# EAGLE design osmo-bts-lna (EAGLE 7.7.0)
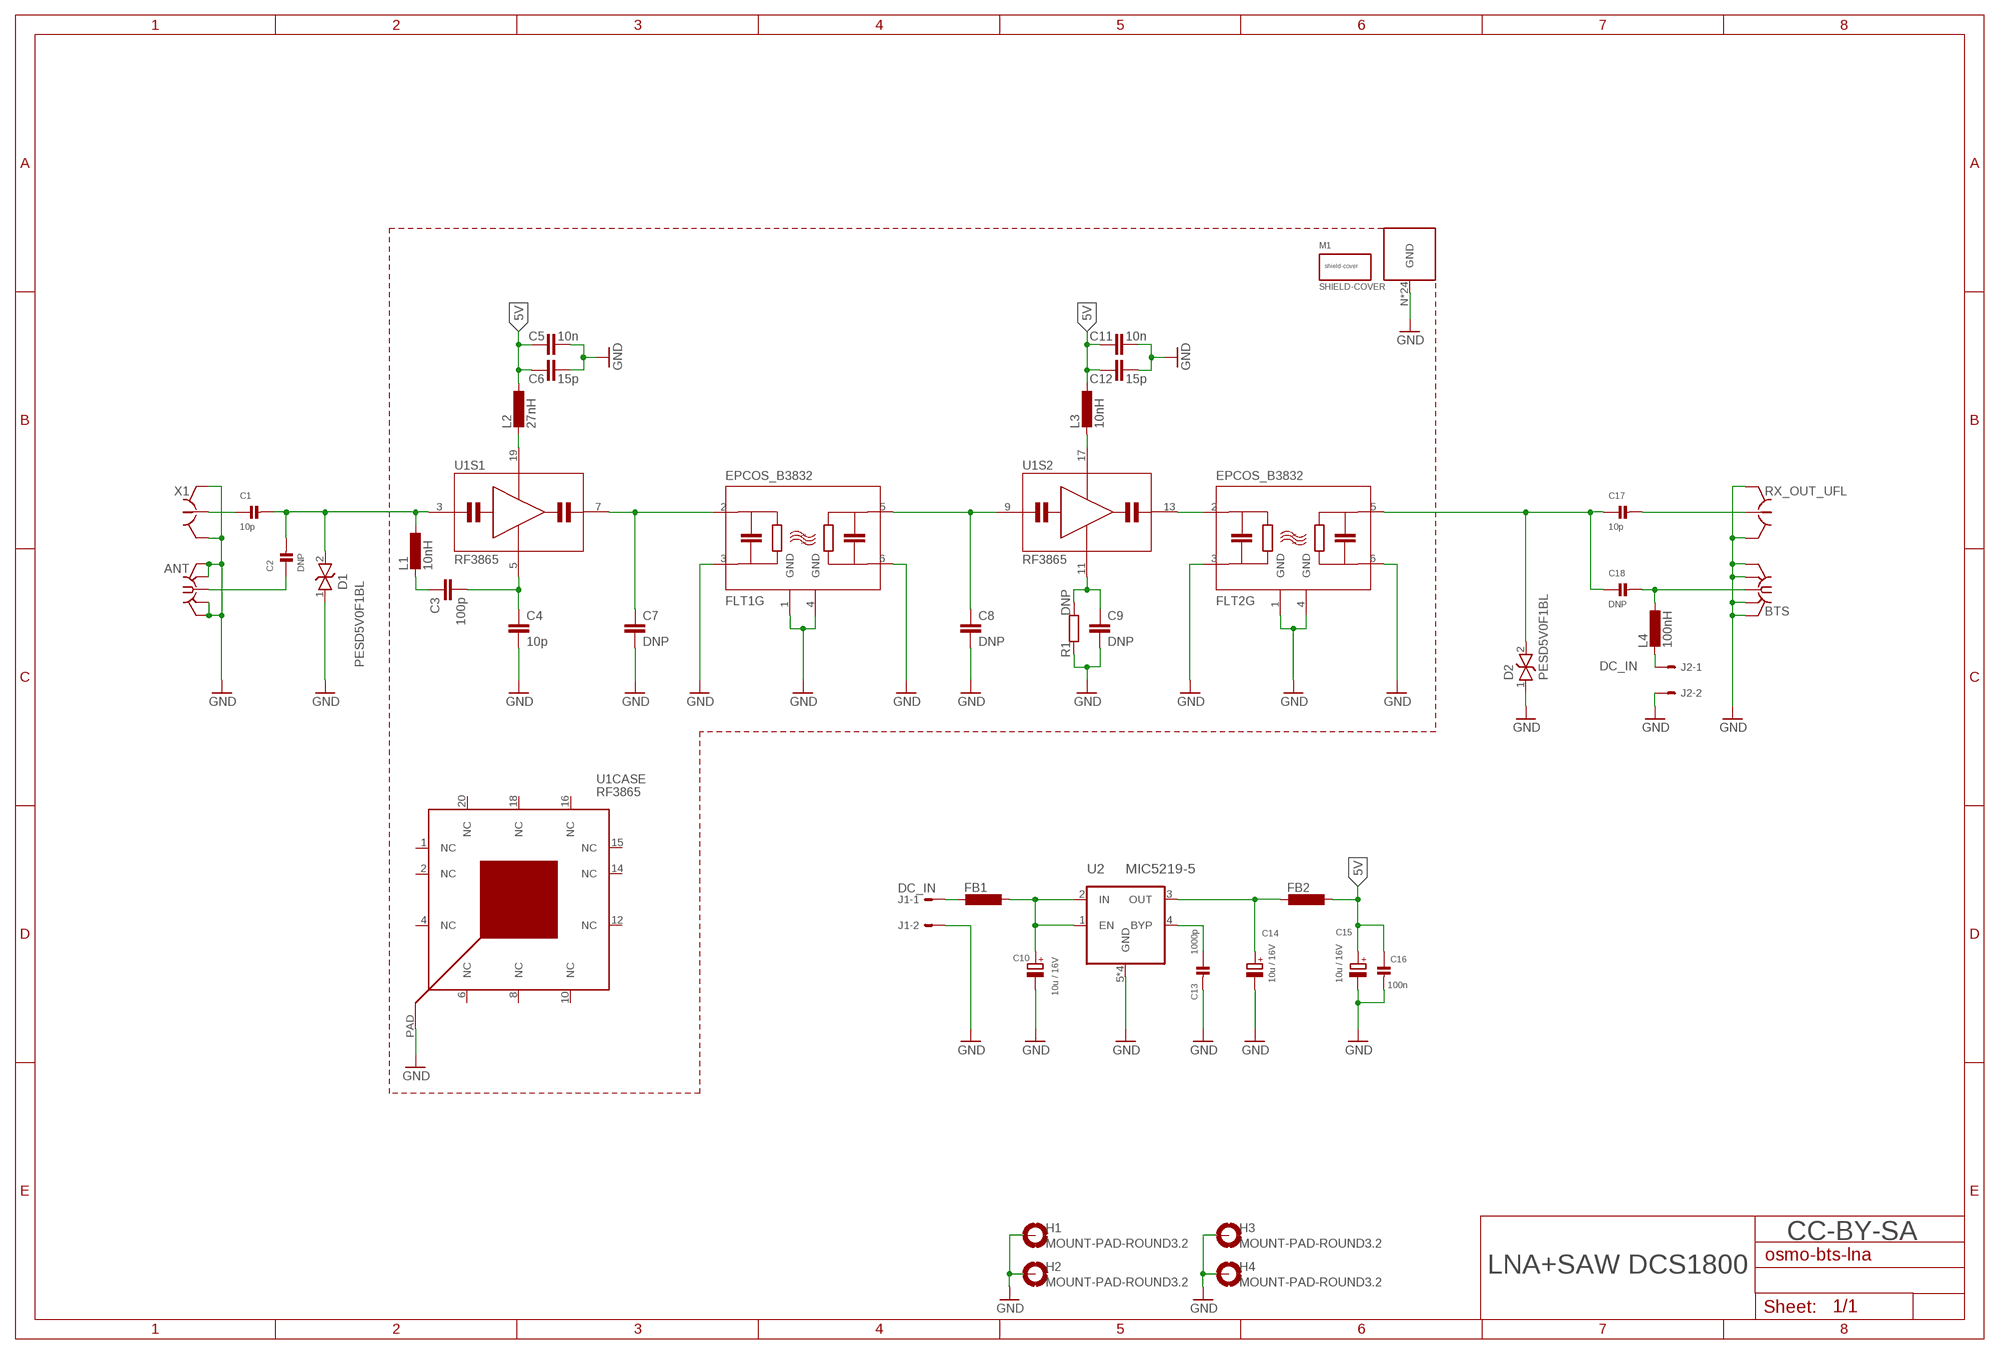
[diagram p0: schematic, sheet 1]
M1 (SHIELD-COVER): CLASS: MECHANICAL; DESCRIPTION: BOARD SHIELD 1.26X1.26" COVER; LINK: https://www.digikey.de/product-detail/de/laird-technologies-emi/BMI-S-204-C/903-1016-ND; MANUFACTURER: Laird Technologies EMI; MANUFACTURERPARTNUMBER: BMI-S-204-C; POPULATED: TRUE; ROHSCERTIFICATE: UNKNOWN ROHS CERTIFICATE; SCHEM_BOM_ITEM: TRUE; SOURCE: DIGIKEY; SOURCEPARTNUMBER: 903-1016-ND

## Parts
ANT  SMA-F-S-EDGE  [SMA-F-S-EDGE]
BTS  SMA-F-S-EDGE  [SMA-F-S-EDGE]
C1  10p  CAP_CERAMIC_0603  [_0603]
C2  DNP  CAP_CERAMIC_0603  [_0603]
C3  100p  C-EU_0603  [0603]
C4  10p  C-EU_0603  [0603]
C5  10n  C-EU_0603  [0603]
C6  15p  C-EU_0603  [0603]
C7  DNP  C-EU_0603  [0603]
C8  DNP  C-EU_0603  [0603]
C9  DNP  C-EU_0603  [0603]
C10  10u / 16V  CPOL-EU-1206  [CPOL1206]
C11  10n  C-EU_0603  [0603]
C12  15p  C-EU_0603  [0603]
C13  1000p  CAP_CERAMIC_0603  [_0603]
C14  10u / 16V  CPOL-EU-1206  [CPOL1206]
C15  10u / 16V  CPOL-EU-1206  [CPOL1206]
C16  100n  CAP_CERAMIC_0603  [_0603]
C17  10p  CAP_CERAMIC_0603  [_0603]
C18  DNP  CAP_CERAMIC_0603  [_0603]
D1  PESD5V0F1BL  D_ESD_SOD882  [SOD882]
D2  PESD5V0F1BL  D_ESD_SOD882  [SOD882]
FB1  FBEAD_1206  [1206]
FB2  INDUCTOR0603  [0603]
FLT1  EPCOS_B3832  [DCC6C]
FLT2  EPCOS_B3832  [DCC6C]
H1  MOUNT-PAD-ROUND3.2  [3,2-PAD]
H2  MOUNT-PAD-ROUND3.2  [3,2-PAD]
H3  MOUNT-PAD-ROUND3.2  [3,2-PAD]
H4  MOUNT-PAD-ROUND3.2  [3,2-PAD]
J1  DC_IN  22-27-2021-02  [6410-02]
J2  DC_IN  22-27-2021-02  [6410-02]
L1  10nH  L-EU_0603  [0603]
L2  27nH  L-EU_0603  [0603]
L3  10nH  L-EU_0603  [0603]
L4  100nH  INDUCTOR_0402  [_0402]
R1  DNP  R-EU_0603  [0603]
RX_OUT_UFL  HRS_UFL  [HRS_UFL]
SHLD1  SHIELD-BMI-S-204  [BMI-S-204]
U1  RF3865  [QFN20_5X5_PAD]
U2  MIC5219-5  MIC5219FMM8  [MSOP8]
X1  HRS_UFL  [HRS_UFL]

## Nets
5V: C5.1 C6.1 C11.1 C12.1 C15.+ C16.1 FB2.2 L2.1 L3.1
DC_IN: FB1.1 J1.1
DC_IN_FLT: C10.+ FB1.2 U2.1(EN) U2.2(IN)
GND: ANT.BG1(GND) ANT.BG2(GND) ANT.TG1(GND) ANT.TG2(GND) BTS.BG1(GND) BTS.BG2(GND) BTS.TG1(GND) BTS.TG2(GND) C4.2 C5.2 C6.2 C7.2 C8.2 C9.2 C10.- C11.2 C12.2 C13.2 C14.- C15.- C16.2 D1.1 D2.1 FLT1.1(CASE:GND) FLT1.3(G:IN_GND) FLT1.4(CASE:GND) FLT1.6(G:OUT_GND) FLT2.1(CASE:GND) FLT2.3(G:IN_GND) FLT2.4(CASE:GND) FLT2.6(G:OUT_GND) H1.B3,2(MOUNT) H2.B3,2(MOUNT) H3.B3,2(MOUNT) H4.B3,2(MOUNT) J1.2 J2.2 R1.1 RX_OUT_UFL.GND@1(GND) RX_OUT_UFL.GND@2(GND) SHLD1.N(GND) SHLD1.NNE1(GND) SHLD1.NNE2(GND) SHLD1.NNE4(GND) SHLD1.NNE5(GND) SHLD1.NNE(GND) SHLD1.NNW(GND) SHLD1.S1(GND) SHLD1.S2(GND) SHLD1.S3(GND) SHLD1.S4(GND) SHLD1.S5(GND) SHLD1.S6(GND) SHLD1.S7(GND) SHLD1.S8(GND) SHLD1.S9(GND) SHLD1.S(GND) SHLD1.SSE(GND) SHLD1.SSW1(GND) SHLD1.SSW2(GND) SHLD1.SSW3(GND) SHLD1.SSW4(GND) SHLD1.SSW5(GND) SHLD1.SSW(GND) U1.PAD(CASE:CASE_GND) U2.5(GND) U2.6(GND) U2.7(GND) U2.8(GND) X1.GND@1(GND) X1.GND@2(GND)
N$1: L2.2 U1.19(S1:VDD)
N$2: ANT.C C2.1
N$3: C13.1 U2.4(BYP)
N$4: C3.1 L1.2
N$5: C3.2 C4.1 U1.5(S1:AC_GND)
N$6: C9.1 R1.2 U1.11(S2:AC_GND)
N$7: C1.1 X1.SIG
N$8: C17.2 RX_OUT_UFL.SIG
N$9: C17.1 C18.1 D2.2 FLT2.5(G:OUT)
N$10: L3.2 U1.17(S2:VDD)
N$11: J2.1 L4.2
N$12: C14.+ FB2.1 U2.3(OUT)
RF_UPLINK: C1.2 C2.2 D1.2 L1.1 U1.3(S1:RF_IN)
RF_UPLINK_IS_IN: C8.1 FLT1.5(G:OUT) U1.9(S2:RF_IN)
RF_UPLINK_IS_OUT: C7.1 FLT1.2(G:IN) U1.7(S1:RF_OUT)
RF_UPLINK_LNA_OUT: FLT2.2(G:IN) U1.13(S2:RF_OUT)
RF_UPLINK_OUT: BTS.C C18.2 L4.1
Unconnected: U1.1(CASE:NC) U1.2(CASE:NC) U1.4(CASE:NC) U1.6(CASE:NC) U1.8(CASE:NC) U1.10(CASE:NC) U1.12(CASE:NC) U1.14(CASE:NC) U1.15(CASE:NC) U1.16(CASE:NC) U1.18(CASE:NC) U1.20(CASE:NC)

## Notes on the sheet
- CC-BY-SA
- LNA+SAW DCS1800

## Library data of the parts
ANT BTS = osmo-bts-lna:SMA-F; CLASS: CONNECTOR; DESCRIPTION: NO DESCRIPTION; LINK: UNKNOWN LINK; MANUFACTURER: UNKNOWN MANUFACTURER; MANUFACTURERPARTNUMBER: UNKNOWN MANUFACTURER PART NUMBER; POPULATED: TRUE; ROHSCERTIFICATE: UNKNOWN ROHS CERTIFICATE; SOURCE: UNKNOWN SOURCE; SOURCEPARTNUMBER: UNKNOWN SOURCE PART NUMBER
C1 C17 = osmo-bts-lna:CAP_CERAMIC: Ceramic Capacitors 0402 - 0402 Surface Mount Capacitors 16pF 50V 5% [Digikey: 445-4899-2-ND] 18pF 50V 5% [Digikey: 490-1281-2-ND] 22pF 50V 5% [Digikey: 490-1283-2-ND] 68pF 50V 5% [Digikey: 490-1289-2-ND] 0.1uF 10V 10% [Digikey: 490-1318-2-ND] 1.0uF 6.3V 10% [Digikey: 490-1320-2-ND] 0603 - 0603 Surface Mount Capacitors 16 pF 50V 5% [Digikey: 445-5051-2-ND] 22 pF 50V [Digikey: PCC220ACVTR-ND] 33 pF 50V 5% [Digikey: 490-1415-1-ND] 56pF 50V 5% [Digikey: 490-1421-1-ND] 220pF 50V 5% [Digikey: 445-1285-1-ND] 680 pF 50V 2200 pF 50V 5% C0G [Digikey: 445-1297-1-ND] 5600 pF 100V 5% X7R [Digikey: 478-3711-1-ND] 0.1 µF 25V 10% [Digikey: PCC2277TR-ND] 0.22 µF 16V 10% X7R [Digikey: 445-1318-1-ND] 1.0 µF 25V 10% [Digikey: 445-5146-2-ND] 0603 - RF Specific 3pF 250V +/-0.1pF RF [Digikey: 712-1347-1-ND] 18 pF 250V 5% [Digikey: 478-3505-1-ND or 712-1322-1-ND] 56 pF 250V 5% C0G RF [Digikey: 490-4867-1-ND] 68 pF 250V RF [Digikey: 490-4868-1-ND] 0805 - 0805 Surface Mount Capacitors 220 pF 250V 2% RF Ceramic Capacitor [Digikey: 712-1398-1-ND] 1000 pF 50V 2% NP0 Ceramic Capacitor [Digikey: 478-3760-1-ND] 0.1 µF 25V 10% Ceramic Capacitor [Digikey: PCC1828TR-ND] 1.0 µF 16V 10% Ceramic Capacitor[Digikey: 490-1691-2-ND] 10.0 µF 10V 10% Ceramic Capacitor[Digikey: 709-1228-1-ND] 10.0 uF 16V 10% Ceramic Capacitor [Digikey: 478-5165-2-ND] 47 uF 6.3V 20% Ceramic Capacitor [Digikey: 587-1779-1-ND or 399-5506-1-ND] 1206 - 1206 Surface Mount Capacitors 47uF 10V 20% Ceramic Capacitor [Digikey: 490-5528-1-ND or 399-5508-1-ND or 445-6010-1-ND] 100uF 6.3V -20%, +80% Y5V Ceramic Capacitor (Digikey: 490-4512-1-ND, Mouser: 81-GRM31CF50J107ZE1L) 1810 - 1810 Surface Mount Capacitors High volt MLC; no solder stop between for higher isolation; CLASS: CAPACITOR; DESCRIPTION: CAP CER 10PF 50V C0G/NP0 0603; LINK: http://www.digikey.de/product-detail/de/C0603C100J5GACTU/399-1049-1-ND; MANUFACTURER: KEMET; MANUFACTURERPARTNUMBER: C0603C100J5GACTU; POPULATED: TRUE; ROHSCERTIFICATE: UNKNOWN ROHS CERTIFICATE; SOURCE: DIGIKEY; SOURCEPARTNUMBER: 399-1049-1-ND
C2 C18 = osmo-bts-lna:CAP_CERAMIC: Ceramic Capacitors 0402 - 0402 Surface Mount Capacitors 16pF 50V 5% [Digikey: 445-4899-2-ND] 18pF 50V 5% [Digikey: 490-1281-2-ND] 22pF 50V 5% [Digikey: 490-1283-2-ND] 68pF 50V 5% [Digikey: 490-1289-2-ND] 0.1uF 10V 10% [Digikey: 490-1318-2-ND] 1.0uF 6.3V 10% [Digikey: 490-1320-2-ND] 0603 - 0603 Surface Mount Capacitors 16 pF 50V 5% [Digikey: 445-5051-2-ND] 22 pF 50V [Digikey: PCC220ACVTR-ND] 33 pF 50V 5% [Digikey: 490-1415-1-ND] 56pF 50V 5% [Digikey: 490-1421-1-ND] 220pF 50V 5% [Digikey: 445-1285-1-ND] 680 pF 50V 2200 pF 50V 5% C0G [Digikey: 445-1297-1-ND] 5600 pF 100V 5% X7R [Digikey: 478-3711-1-ND] 0.1 µF 25V 10% [Digikey: PCC2277TR-ND] 0.22 µF 16V 10% X7R [Digikey: 445-1318-1-ND] 1.0 µF 25V 10% [Digikey: 445-5146-2-ND] 0603 - RF Specific 3pF 250V +/-0.1pF RF [Digikey: 712-1347-1-ND] 18 pF 250V 5% [Digikey: 478-3505-1-ND or 712-1322-1-ND] 56 pF 250V 5% C0G RF [Digikey: 490-4867-1-ND] 68 pF 250V RF [Digikey: 490-4868-1-ND] 0805 - 0805 Surface Mount Capacitors 220 pF 250V 2% RF Ceramic Capacitor [Digikey: 712-1398-1-ND] 1000 pF 50V 2% NP0 Ceramic Capacitor [Digikey: 478-3760-1-ND] 0.1 µF 25V 10% Ceramic Capacitor [Digikey: PCC1828TR-ND] 1.0 µF 16V 10% Ceramic Capacitor[Digikey: 490-1691-2-ND] 10.0 µF 10V 10% Ceramic Capacitor[Digikey: 709-1228-1-ND] 10.0 uF 16V 10% Ceramic Capacitor [Digikey: 478-5165-2-ND] 47 uF 6.3V 20% Ceramic Capacitor [Digikey: 587-1779-1-ND or 399-5506-1-ND] 1206 - 1206 Surface Mount Capacitors 47uF 10V 20% Ceramic Capacitor [Digikey: 490-5528-1-ND or 399-5508-1-ND or 445-6010-1-ND] 100uF 6.3V -20%, +80% Y5V Ceramic Capacitor (Digikey: 490-4512-1-ND, Mouser: 81-GRM31CF50J107ZE1L) 1810 - 1810 Surface Mount Capacitors High volt MLC; no solder stop between for higher isolation; CLASS: CAPACITOR; DESCRIPTION: NO DESCRIPTION; LINK: UNKNOWN LINK; MANUFACTURER: UNKNOWN MANUFACTURER; MANUFACTURERPARTNUMBER: UNKNOWN MANUFACTURER PART NUMBER; POPULATED: TRUE; ROHSCERTIFICATE: UNKNOWN ROHS CERTIFICATE; SOURCE: UNKNOWN SOURCE; SOURCEPARTNUMBER: UNKNOWN SOURCE PART NUMBER
C3 = osmo-bts-lna:C-EU: Capacitor; CLASS: CAPACITOR; DESCRIPTION: CAP CER 100PF 50V C0G/NP0 0603; LINK: https://www.digikey.de/product-detail/de/avx-corporation/06035A101FAT2A/478-6202-1-ND; MANUFACTURER: AVX Corporation; MANUFACTURERPARTNUMBER: 06035A101FAT2A; POPULATED: TRUE; ROHSCERTIFICATE: UNKNOWN ROHS CERTIFICATE; SOURCE: DIGIKEY; SOURCEPARTNUMBER: 478-6202-1-ND
C4 = osmo-bts-lna:C-EU: Capacitor; CLASS: CAPACITOR; DESCRIPTION: CAP CER 10PF 50V C0G/NP0 0603; LINK: http://www.digikey.de/product-detail/de/C0603C100J5GACTU/399-1049-1-ND; MANUFACTURER: KEMET; MANUFACTURERPARTNUMBER: C0603C100J5GACTU; POPULATED: TRUE; ROHSCERTIFICATE: UNKNOWN ROHS CERTIFICATE; SOURCE: DIGIKEY; SOURCEPARTNUMBER: 399-1049-1-ND
C5 C11 = osmo-bts-lna:C-EU: Capacitor; CLASS: CAPACITOR; DESCRIPTION: CAP CER 10000PF 100V X7R 0603; LINK: https://www.digikey.de/product-detail/de/murata-electronics-north-america/GCM188R72A103KA37D/490-4781-1-ND; MANUFACTURER: Murata Electronics North America; MANUFACTURERPARTNUMBER: GCM188R72A103KA37D; POPULATED: TRUE; ROHSCERTIFICATE: UNKNOWN ROHS CERTIFICATE; SOURCE: DIGIKEY; SOURCEPARTNUMBER: 490-4781-1-ND
C6 C12 = osmo-bts-lna:C-EU: Capacitor; CLASS: CAPACITOR; DESCRIPTION: CAP CER 15PF 50V C0G/NP0 0603; LINK: https://www.digikey.de/product-detail/de/samsung-electro-mechanics/CL10C150JB8NCNC/1276-2190-1-ND; MANUFACTURER: Samsung Electro-Mechanics; MANUFACTURERPARTNUMBER: CL10C150JB8NCNC; POPULATED: TRUE; ROHSCERTIFICATE: UNKNOWN ROHS CERTIFICATE; SOURCE: DIGIKEY; SOURCEPARTNUMBER: 1276-2190-1-ND
C7-C9 = osmo-bts-lna:C-EU: Capacitor; CLASS: CAPACITOR; DESCRIPTION: NO DESCRIPTION; LINK: UNKNOWN LINK; MANUFACTURER: UNKNOWN MANUFACTURER; MANUFACTURERPARTNUMBER: UNKNOWN MANUFACTURER PART NUMBER; POPULATED: FALSE; ROHSCERTIFICATE: UNKNOWN ROHS CERTIFICATE; SOURCE: UNKNOWN SOURCE; SOURCEPARTNUMBER: UNKNOWN SOURCE PART NUMBER
C10 C14 C15 = osmo-bts-lna:CPOL-EU; CLASS: CAPACITOR; DESCRIPTION: CAP CER 10UF 16V X5R 0805; LINK: https://www.digikey.de/product-detail/de/samsung-electro-mechanics/CL21A106KOCLRNC/1276-2399-1-ND; MANUFACTURER: Samsung Electro-Mechanics; MANUFACTURERPARTNUMBER: CL21A106KOCLRNC; POPULATED: TRUE; ROHSCERTIFICATE: UNKNOWN ROHS CERTIFICATE; SOURCE: DIGIKEY; SOURCEPARTNUMBER: 1276-2399-1-ND
C13 = osmo-bts-lna:CAP_CERAMIC: Ceramic Capacitors 0402 - 0402 Surface Mount Capacitors 16pF 50V 5% [Digikey: 445-4899-2-ND] 18pF 50V 5% [Digikey: 490-1281-2-ND] 22pF 50V 5% [Digikey: 490-1283-2-ND] 68pF 50V 5% [Digikey: 490-1289-2-ND] 0.1uF 10V 10% [Digikey: 490-1318-2-ND] 1.0uF 6.3V 10% [Digikey: 490-1320-2-ND] 0603 - 0603 Surface Mount Capacitors 16 pF 50V 5% [Digikey: 445-5051-2-ND] 22 pF 50V [Digikey: PCC220ACVTR-ND] 33 pF 50V 5% [Digikey: 490-1415-1-ND] 56pF 50V 5% [Digikey: 490-1421-1-ND] 220pF 50V 5% [Digikey: 445-1285-1-ND] 680 pF 50V 2200 pF 50V 5% C0G [Digikey: 445-1297-1-ND] 5600 pF 100V 5% X7R [Digikey: 478-3711-1-ND] 0.1 µF 25V 10% [Digikey: PCC2277TR-ND] 0.22 µF 16V 10% X7R [Digikey: 445-1318-1-ND] 1.0 µF 25V 10% [Digikey: 445-5146-2-ND] 0603 - RF Specific 3pF 250V +/-0.1pF RF [Digikey: 712-1347-1-ND] 18 pF 250V 5% [Digikey: 478-3505-1-ND or 712-1322-1-ND] 56 pF 250V 5% C0G RF [Digikey: 490-4867-1-ND] 68 pF 250V RF [Digikey: 490-4868-1-ND] 0805 - 0805 Surface Mount Capacitors 220 pF 250V 2% RF Ceramic Capacitor [Digikey: 712-1398-1-ND] 1000 pF 50V 2% NP0 Ceramic Capacitor [Digikey: 478-3760-1-ND] 0.1 µF 25V 10% Ceramic Capacitor [Digikey: PCC1828TR-ND] 1.0 µF 16V 10% Ceramic Capacitor[Digikey: 490-1691-2-ND] 10.0 µF 10V 10% Ceramic Capacitor[Digikey: 709-1228-1-ND] 10.0 uF 16V 10% Ceramic Capacitor [Digikey: 478-5165-2-ND] 47 uF 6.3V 20% Ceramic Capacitor [Digikey: 587-1779-1-ND or 399-5506-1-ND] 1206 - 1206 Surface Mount Capacitors 47uF 10V 20% Ceramic Capacitor [Digikey: 490-5528-1-ND or 399-5508-1-ND or 445-6010-1-ND] 100uF 6.3V -20%, +80% Y5V Ceramic Capacitor (Digikey: 490-4512-1-ND, Mouser: 81-GRM31CF50J107ZE1L) 1810 - 1810 Surface Mount Capacitors High volt MLC; no solder stop between for higher isolation; CLASS: CAPACITOR; DESCRIPTION: CAP CER 1000PF 16V 10% X7R 0402; LINK: http://www.digikey.de/product-detail/de/CC0402KRX7R7BB102/311-1352-1-ND/2103136; MANUFACTURER: Yageo; MANUFACTURERPARTNUMBER: CC0402KRX7R7BB102; POPULATED: TRUE; ROHSCERTIFICATE: Bleifrei / RoHS-konform; SOURCE: DIGIKEY; SOURCEPARTNUMBER: 311-1352-1-ND
C16 = osmo-bts-lna:CAP_CERAMIC: Ceramic Capacitors 0402 - 0402 Surface Mount Capacitors 16pF 50V 5% [Digikey: 445-4899-2-ND] 18pF 50V 5% [Digikey: 490-1281-2-ND] 22pF 50V 5% [Digikey: 490-1283-2-ND] 68pF 50V 5% [Digikey: 490-1289-2-ND] 0.1uF 10V 10% [Digikey: 490-1318-2-ND] 1.0uF 6.3V 10% [Digikey: 490-1320-2-ND] 0603 - 0603 Surface Mount Capacitors 16 pF 50V 5% [Digikey: 445-5051-2-ND] 22 pF 50V [Digikey: PCC220ACVTR-ND] 33 pF 50V 5% [Digikey: 490-1415-1-ND] 56pF 50V 5% [Digikey: 490-1421-1-ND] 220pF 50V 5% [Digikey: 445-1285-1-ND] 680 pF 50V 2200 pF 50V 5% C0G [Digikey: 445-1297-1-ND] 5600 pF 100V 5% X7R [Digikey: 478-3711-1-ND] 0.1 µF 25V 10% [Digikey: PCC2277TR-ND] 0.22 µF 16V 10% X7R [Digikey: 445-1318-1-ND] 1.0 µF 25V 10% [Digikey: 445-5146-2-ND] 0603 - RF Specific 3pF 250V +/-0.1pF RF [Digikey: 712-1347-1-ND] 18 pF 250V 5% [Digikey: 478-3505-1-ND or 712-1322-1-ND] 56 pF 250V 5% C0G RF [Digikey: 490-4867-1-ND] 68 pF 250V RF [Digikey: 490-4868-1-ND] 0805 - 0805 Surface Mount Capacitors 220 pF 250V 2% RF Ceramic Capacitor [Digikey: 712-1398-1-ND] 1000 pF 50V 2% NP0 Ceramic Capacitor [Digikey: 478-3760-1-ND] 0.1 µF 25V 10% Ceramic Capacitor [Digikey: PCC1828TR-ND] 1.0 µF 16V 10% Ceramic Capacitor[Digikey: 490-1691-2-ND] 10.0 µF 10V 10% Ceramic Capacitor[Digikey: 709-1228-1-ND] 10.0 uF 16V 10% Ceramic Capacitor [Digikey: 478-5165-2-ND] 47 uF 6.3V 20% Ceramic Capacitor [Digikey: 587-1779-1-ND or 399-5506-1-ND] 1206 - 1206 Surface Mount Capacitors 47uF 10V 20% Ceramic Capacitor [Digikey: 490-5528-1-ND or 399-5508-1-ND or 445-6010-1-ND] 100uF 6.3V -20%, +80% Y5V Ceramic Capacitor (Digikey: 490-4512-1-ND, Mouser: 81-GRM31CF50J107ZE1L) 1810 - 1810 Surface Mount Capacitors High volt MLC; no solder stop between for higher isolation; CLASS: CAPACITOR; DESCRIPTION: CAP CER 0.1UF 16V X7R 0603; LINK: http://www.digikey.de/product-detail/de/foo/1276-1005-1-ND; MANUFACTURER: Samsung Electro-Mechanics; MANUFACTURERPARTNUMBER: CL10B104KO8NNNC; POPULATED: TRUE; ROHSCERTIFICATE: UNKNOWN ROHS CERTIFICATE; SOURCE: DIGIKEY; SOURCEPARTNUMBER: 1276-1005-1-ND
D1 D2 = osmo-bts-lna:D_ESD: Diode for ESD Protection Transient suppressors; CLASS: DIODE; DESCRIPTION: TVS DIODE 5.5V 15V SOD882; LINK: https://www.digikey.de/product-detail/de/nexperia-usa-inc/PESD5V0F1BL315/1727-5794-1-ND; MANUFACTURER: Nexperia USA Inc.; MANUFACTURERPARTNUMBER: PESD5V0F1BL,315; POPULATED: TRUE; ROHSCERTIFICATE: UNKNOWN ROHS CERTIFICATE; SOURCE: DIGIKEY; SOURCEPARTNUMBER: 1727-5794-1-ND
FB1 = osmo-bts-lna:FBEAD: INDUCTOR SMD Bead inductor; CLASS: INDUCTOR; DESCRIPTION: FERRITE BEAD 1 KOHM 0805 1LN; LINK: https://www.digikey.de/product-detail/de/laird-signal-integrity-products/HZ0805D102R-10/240-2397-1-ND; MANUFACTURER: Laird-Signal Integrity Products; MANUFACTURERPARTNUMBER: HZ0805D102R-10; POPULATED: TRUE; ROHSCERTIFICATE: UNKNOWN ROHS CERTIFICATE; SOURCE: DIGIKEY; SOURCEPARTNUMBER: 240-2397-1-ND
FB2 = osmo-bts-lna:INDUCTOR; CLASS: INDUCTOR; DESCRIPTION: FERRITE BEAD 1 KOHM 0805 1LN; LINK: https://www.digikey.de/product-detail/de/laird-signal-integrity-products/HZ0805D102R-10/240-2397-1-ND; MANUFACTURER: Laird-Signal Integrity Products; MANUFACTURERPARTNUMBER: HZ0805D102R-10; POPULATED: TRUE; ROHSCERTIFICATE: UNKNOWN ROHS CERTIFICATE; SOURCE: DIGIKEY; SOURCEPARTNUMBER: 240-2397-1-ND
FLT1 FLT2 = osmo-bts-lna:EPCOS_B3832; CLASS: UNKNOWN CLASS; DESCRIPTION: NO DESCRIPTION; LINK: UNKNOWN LINK; MANUFACTURER: UNKNOWN MANUFACTURER; MANUFACTURERPARTNUMBER: UNKNOWN MANUFACTURER PART NUMBER; POPULATED: TRUE; ROHSCERTIFICATE: UNKNOWN ROHS CERTIFICATE; SOURCE: UNKNOWN SOURCE; SOURCEPARTNUMBER: UNKNOWN SOURCE PART NUMBER
H1-H4 = osmo-bts-lna:MOUNT-PAD-ROUND: MOUNTING PAD, round; CLASS: HOLE; DESCRIPTION: NO DESCRIPTION; LINK: UNKNOWN LINK; MANUFACTURER: UNKNOWN MANUFACTURER; MANUFACTURERPARTNUMBER: UNKNOWN MANUFACTURER PART NUMBER; POPULATED: FALSE; ROHSCERTIFICATE: UNKNOWN ROHS CERTIFICATE; SOURCE: UNKNOWN SOURCE; SOURCEPARTNUMBER: UNKNOWN SOURCE PART NUMBER
J1 J2 = osmo-bts-lna:22-?-02: CONNECTOR wire to board 2.54 mm (.1 inch) pitch header; CLASS: CONNECTOR\JUMPER; DESCRIPTION: NO DESCRIPTION; LINK: UNKNOWN LINK; MANUFACTURER: UNKNOWN MANUFACTURER; MANUFACTURERPARTNUMBER: UNKNOWN MANUFACTURER PART NUMBER; OC_FARNELL: unknown; OC_NEWARK: unknown; POPULATED: TRUE; ROHSCERTIFICATE: UNKNOWN ROHS CERTIFICATE; SOURCE: UNKNOWN SOURCE; SOURCEPARTNUMBER: UNKNOWN SOURCE PART NUMBER
L1 L3 = osmo-bts-lna:L-EU: Inductor; CLASS: INDUCTOR; DESCRIPTION: FIXED IND 10NH 700MA 130 MOHM; LINK: https://www.digikey.de/product-detail/de/bourns-inc/PM0603-10NJ-RC/M8484CT-ND; MANUFACTURER: Bourns Inc.; MANUFACTURERPARTNUMBER: PM0603-10NJ-RC; POPULATED: TRUE; ROHSCERTIFICATE: UNKNOWN ROHS CERTIFICATE; SOURCE: DIGIKEY; SOURCEPARTNUMBER: M8484CT-ND
L2 = osmo-bts-lna:L-EU: Inductor; CLASS: INDUCTOR; DESCRIPTION: FIXED IND 27NH 600MA 220 MOHM; LINK: https://www.digikey.de/product-detail/de/bourns-inc/PM0603-27NJ-RC/M8486CT-ND; MANUFACTURER: Bourns Inc.; MANUFACTURERPARTNUMBER: PM0603-27NJ-RC; POPULATED: TRUE; ROHSCERTIFICATE: UNKNOWN ROHS CERTIFICATE; SOURCE: DIGIKEY; SOURCEPARTNUMBER: M8486CT-ND
L4 = osmo-bts-lna:INDUCTOR; CLASS: INDUCTOR; DESCRIPTION: FIXED IND 100NH 500MA 1.25 OHM; LINK: https://www.digikey.de/product-detail/de/murata-electronics-north-america/LQG15HHR10J02D/490-11670-1-ND; MANUFACTURER: Murata Electronics North America; MANUFACTURERPARTNUMBER: LQG15HHR10J02D; POPULATED: TRUE; ROHSCERTIFICATE: UNKNOWN ROHS CERTIFICATE; SOURCE: DIGIKEY; SOURCEPARTNUMBER: 490-11670-1-ND
R1 = osmo-bts-lna:R-EU: Resistor; CLASS: RESISTOR; DESCRIPTION: NO DESCRIPTION; LINK: UNKNOWN LINK; MANUFACTURER: UNKNOWN MANUFACTURER; MANUFACTURERPARTNUMBER: UNKNOWN MANUFACTURER PART NUMBER; POPULATED: TRUE; ROHSCERTIFICATE: UNKNOWN ROHS CERTIFICATE; SOURCE: UNKNOWN SOURCE; SOURCEPARTNUMBER: UNKNOWN SOURCE PART NUMBER
RX_OUT_UFL X1 = osmo-bts-lna:HRS_UFL: Hirose U.FL SMT; CLASS: CONNECTOR; DESCRIPTION: CONN U.FL RCPT STR 50 OHM SMD; LINK: http://www.digikey.de/product-detail/de/hirose-electric-co-ltd/U.FL-R-SMT(01)/H9161-ND; MANUFACTURER: Hirose Electric Co Ltd; MANUFACTURERPARTNUMBER: U.FL-R-SMT(01); POPULATED: TRUE; ROHSCERTIFICATE: UNKNOWN ROHS CERTIFICATE; SOURCE: DIGIKEY; SOURCEPARTNUMBER: H9161-ND
SHLD1 = osmo-bts-lna:SHIELD: RF Shield Covers; CLASS: MECHANICAL; DESCRIPTION: BOARD SHIELD 1.26X1.26" FRAME; LINK: https://www.digikey.de/product-detail/de/laird-technologies-emi/BMI-S-204-F/903-1053-1-ND; MANUFACTURER: Laird Technologies EMI; MANUFACTURERPARTNUMBER: BMI-S-204-F; POPULATED: TRUE; ROHSCERTIFICATE: UNKNOWN ROHS CERTIFICATE; SOURCE: DIGIKEY; SOURCEPARTNUMBER: 903-1053-1-ND
U1 = osmo-bts-lna:RF3865: RF3865 wide bandwidth, high linearity low noise amplifier (LNA) / llinear driver; CLASS: IC; DESCRIPTION: NO DESCRIPTION; LINK: UNKNOWN LINK; MANUFACTURER: UNKNOWN MANUFACTURER; MANUFACTURERPARTNUMBER: UNKNOWN MANUFACTURER PART NUMBER; POPULATED: TRUE; ROHSCERTIFICATE: UNKNOWN ROHS CERTIFICATE; SOURCE: UNKNOWN SOURCE; SOURCEPARTNUMBER: UNKNOWN SOURCE PART NUMBER
U2 = osmo-bts-lna:MIC5219FMM: MIC5219; fixed voltage versions in (MSOP8/MSOP08/TSSOP08); CLASS: IC; DESCRIPTION: IC REG LINEAR 5V 500MA 8MSOP; LINK: https://www.digikey.de/product-detail/de/microchip-technology/MIC5219-5.0YMM/576-1828-5-ND; MANUFACTURER: Microchip Technology; MANUFACTURERPARTNUMBER: MIC5219-5.0YMM; POPULATED: TRUE; ROHSCERTIFICATE: UNKNOWN ROHS CERTIFICATE; SOURCE: DIGIKEY; SOURCEPARTNUMBER: 576-1828-5-ND

## Net classes
3 supply: width 0.6 mm

## Board
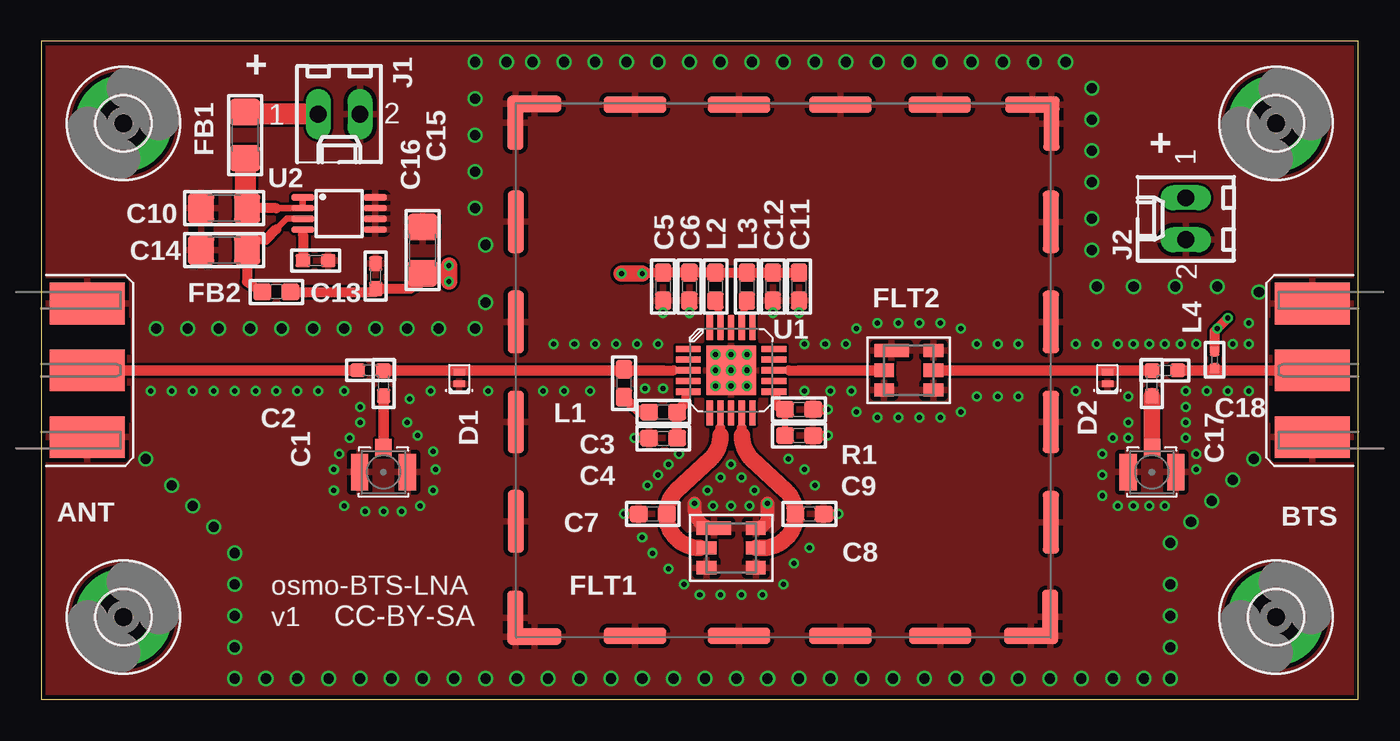
[diagram p1: board, top side]
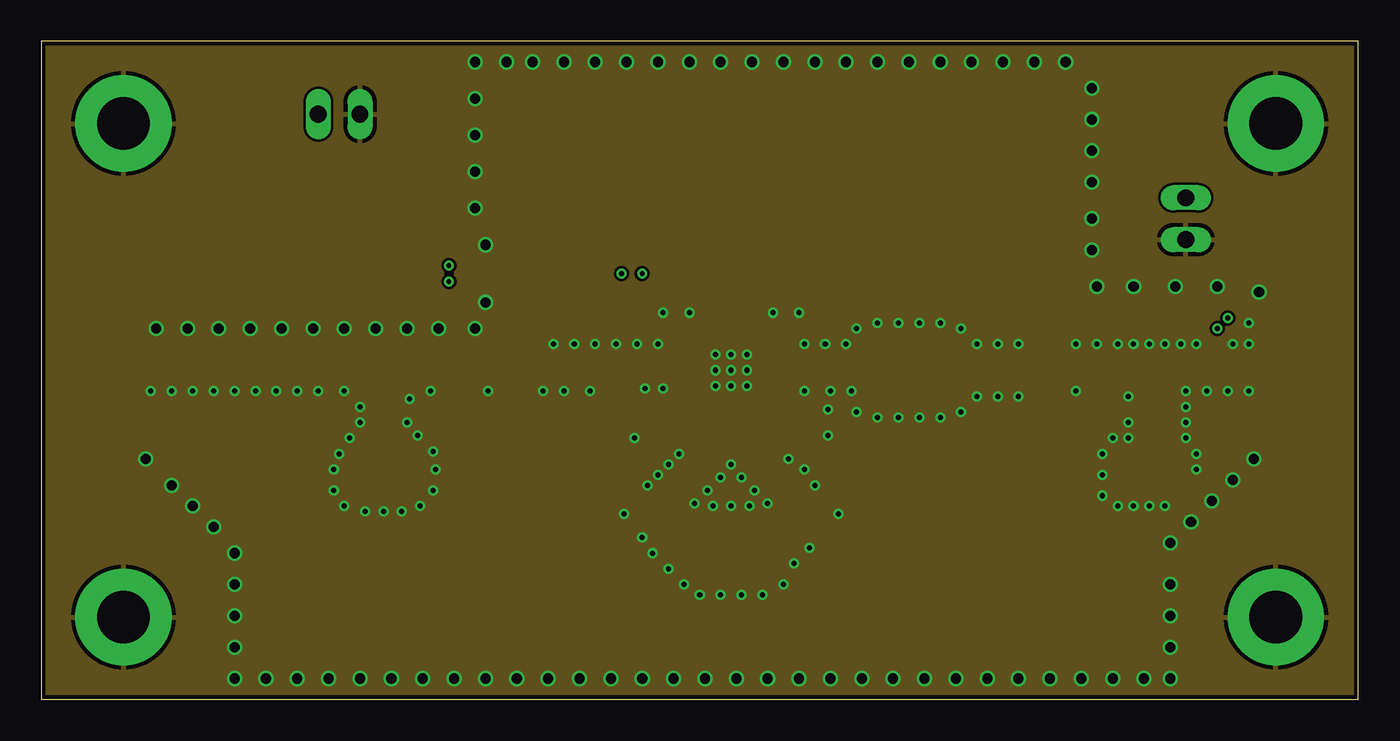
[diagram p2: board, inner layer Route2]
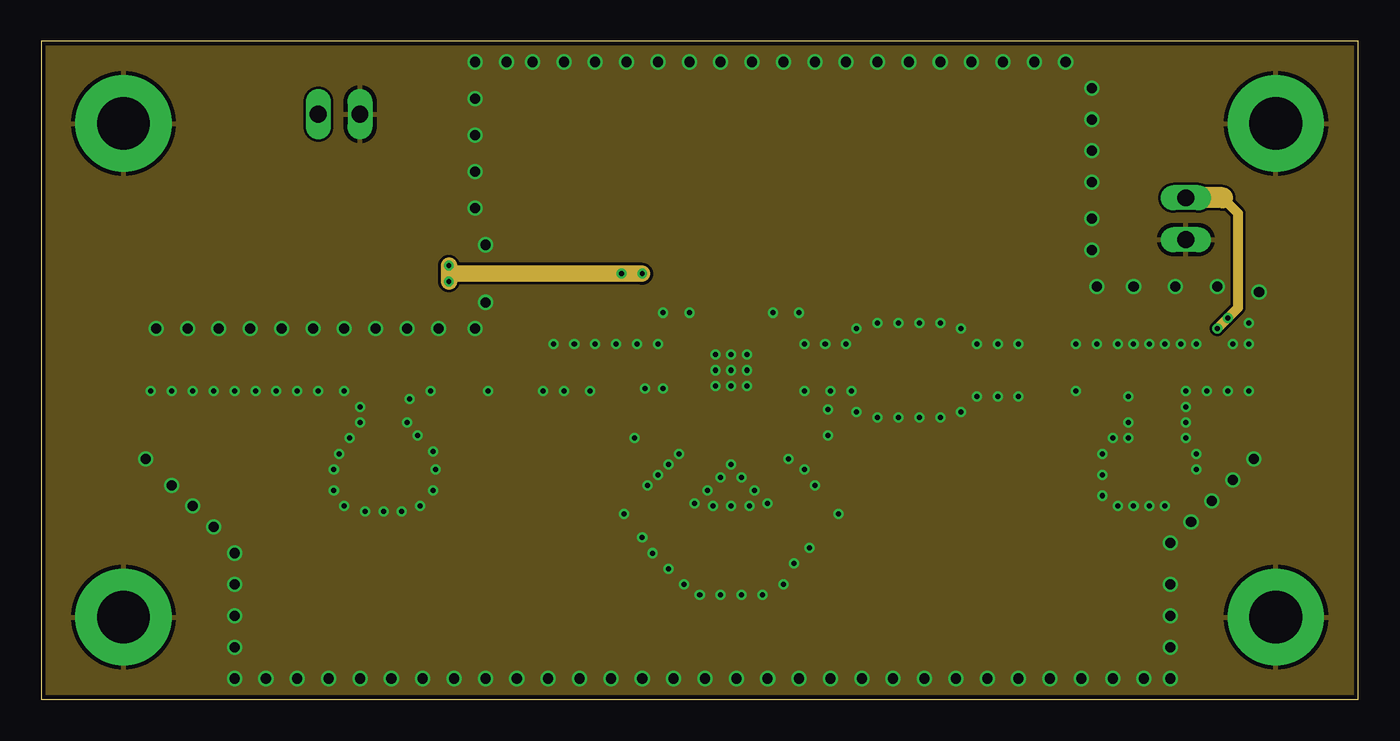
[diagram p3: board, inner layer Route15]
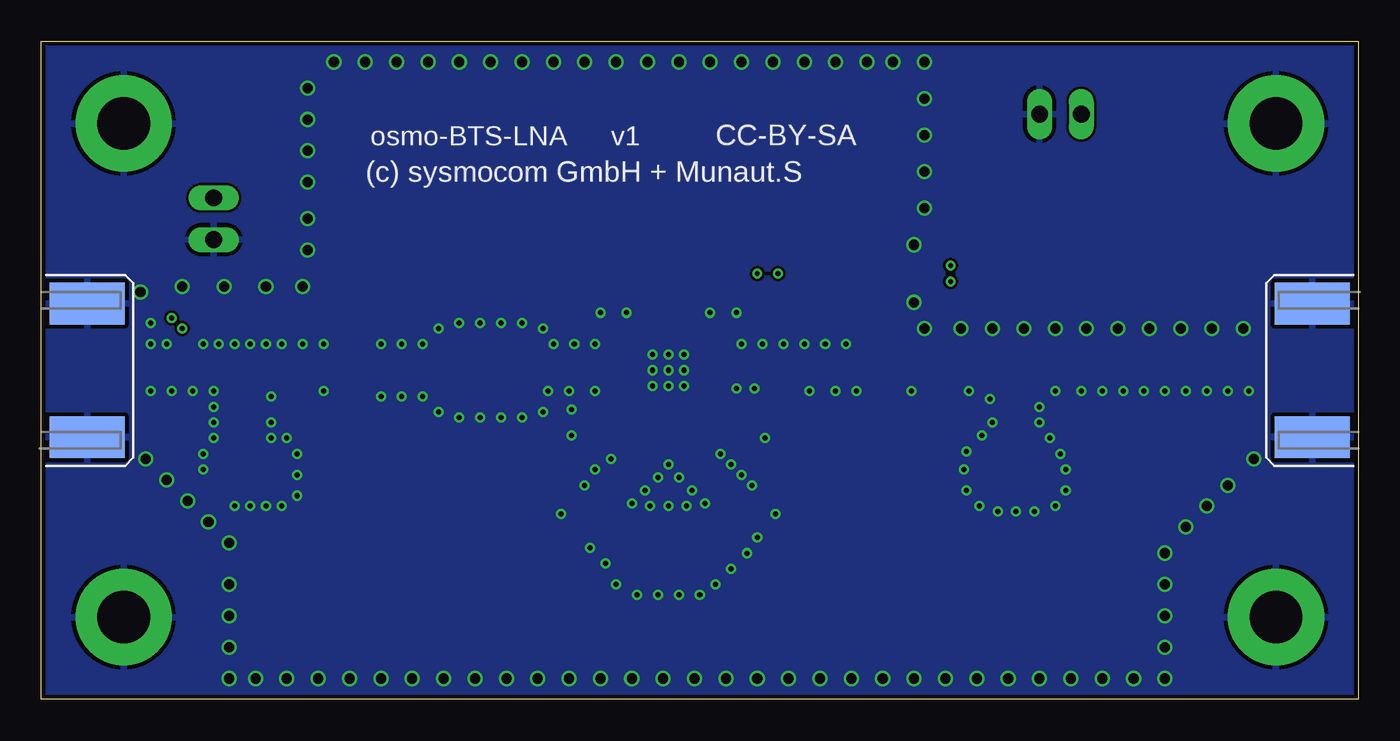
[diagram p4: board, bottom side, seen from below]

Size 80.01 x 40 mm. Coordinates in mm from the lower left corner, seen from the top.
Outline: 0,0 80,0 80,40 0,40 0,0
Copper layers (1+2*15+16): Top 0.035mm / dielectric 0.36mm / Route2 0.035mm / dielectric 0.71mm / Route15 0.035mm / dielectric 0.36mm / Bottom 0.035mm
Design rules "default *": minimum track width 6mil, minimum drill 12mil, track to track 6mil, track to pad 6mil, pad to pad 6mil, via to via 6mil, smd to smd 0mil, copper to edge 10mil, drill to drill 10mil, minimum pad ring 10mil, minimum via ring 6mil, stop-mask expansion 2mil, vias tented up to drill 100mil, thermal gap 10mil
tRestrict: area 41.6,10.2 to 41.9,10.5; area 52.4,21 to 52.7,21.3; area 0.3,21 to 5.4,23.2; area 74.6,21 to 79.7,23.2; area 74.6,16.8 to 79.7,19; area 0.3,16.8 to 5.4,19

### Footprints (pad centres in the part's own frame; a part is rotated, then mirrored left to right if it is on the bottom)
SMA-F-S-EDGE = smd 4.572 x 2.54 bottom: BG1 2.794,-4.064; BG2 2.794,4.064 | smd 4.572 x 2.54: C 2.794,0; TG1 2.794,-4.064; TG2 2.794,4.064
_0603 = smd 0.9 x 0.8: 1 -0.762,0; 2 0.762,0
0603 = smd 1.1 x 1: 1 -0.85,0; 2 0.85,0
CPOL1206 = smd 1.6 x 1.8: + 1.4,0; - -1.4,0
SOD882 = smd 0.4 x 0.7: 1 -0.35,0; 2 0.35,0
1206 = smd 1.6 x 1.8: 1 -1.4,0; 2 1.4,0
DCC6C = smd 0.8 x 2.1: 1 1.2,1.05 | smd 0.8 x 1.2: 2 0,1.5; 3 -1.2,1.5; 4 -1.2,-1.5; 5 0,-1.5; 6 1.2,-1.5
3,2-PAD = drill 3.2 pad 5.842: B3,2 0,0
6410-02 = drill 1.016 long: 1 1.27,0; 2 -1.27,0
_0402 = smd 0.6 x 0.6: 1 -0.508,0; 2 0.508,0
HRS_UFL = smd 1.05 x 2.2: GND@1 -1.452,0; GND@2 1.452,0 | smd 1 x 1.05: SIG 0,-1.502
BMI-S-204 = smd 3.8 x 1: N -2.699,16.135; NNE 3.46,16.135; NNE1 9.492,16.135; NNW -9.016,16.135; S -2.699,-16.135; S1 9.525,-16.135; SSE 3.46,-16.135; SSW -9.016,-16.135 | smd 1 x 3.8: NNE2 16.25,9.016; NNE4 16.25,-3.143; NNE5 16.25,-9.24; SSW1 -16.25,9.018; SSW2 -16.25,2.938; SSW3 -16.25,-3.143; SSW4 -16.25,-9.175; SSW5 16.25,2.938 | smd 3.3 x 1: S2 15.049,-16.135; S5 -15.127,-16.188; S7 15.127,16.14; S8 -15.127,16.183 | smd 1 x 3.3: S3 16.204,-14.985; S4 -16.277,-15.033; S6 16.277,14.985; S9 -16.282,15.033
QFN20_5X5_PAD = smd 1.5 x 0.375: 1 -2.6,1.3; 2 -2.6,0.65; 3 -2.6,0; 4 -2.6,-0.65; 5 -2.6,-1.3; 11 2.6,-1.3; 12 2.6,-0.65; 13 2.6,0; 14 2.6,0.65; 15 2.6,1.3 | smd 0.375 x 1.5: 6 -1.3,-2.6; 7 -0.65,-2.6; 8 0,-2.6; 9 0.65,-2.6; 10 1.3,-2.6; 16 1.3,2.6; 17 0.65,2.6; 18 0,2.6; 19 -0.65,2.6; 20 -1.3,2.6 | smd 3 x 3: PAD 0,0
MSOP8 = smd 0.4 x 1.4: 1 -0.975,-2.2; 2 -0.325,-2.2; 3 0.325,-2.2; 4 0.975,-2.2; 5 0.975,2.2; 6 0.325,2.2; 7 -0.325,2.2; 8 -0.975,2.2

### Placement (x,y rotation side)
ANT  0,20 0 top
BTS  80.01,20 180 top
C1  20.8,19.21 90 top
C2  20,20 0 top
C3  37.78,17.46 0 top
C4  37.78,15.88 180 top
C5  37.78,25.08 270 top
C6  39.37,25.08 270 top
C7  37.15,11.27 180 top
C8  46.67,11.27 0 top
C9  46.04,16.03 0 top
C10  11.11,29.84 0 top
C11  46.04,25.08 270 top
C12  44.45,25.08 270 top
C13  16.67,26.67 0 top
C14  11.11,27.3 0 top
C15  23.18,27.3 270 top
C16  20.32,25.72 90 top
C17  67.47,19.21 270 top
C18  68.26,20 0 top
D1  25.4,19.53 90 top
D2  64.77,19.53 90 top
FB1  12.38,34.29 270 top
FB2  14.29,24.77 0 top
FLT1  41.91,9.21 90 top
FLT2  52.7,20 90 top
H1  5,35 0 top
H2  75,35 0 top
H3  5,5 0 top
H4  75,5 0 top
J1  18.1,35.56 180 top
J2  69.53,29.21 90 top
L1  35.4,19.21 270 top
L2  40.96,25.08 270 top
L3  42.86,25.08 270 top
L4  71.28,20.64 90 top
R1  46.04,17.62 180 top
RX_OUT_UFL  67.47,13.81 180 top
SHLD1  45.09,20 0 top
U1  41.91,20 0 top
U2  18.1,29.53 270 top
X1  20.8,13.81 180 top

### Tracks (layer width: path | path; a pad name or v marks a point on that pad's centre or on a via)
5V  (via drill 0.3)
  Top 0.61: C11.1 C12.1 L3.1 L2.1 C6.1 C5.1 v36.51,25.88 | FB2.2 20.32,24.77 C16.1 22.42,24.96 23.18,25.4 C15.+
  Top 1.016: v36.51,25.88 v35.24,25.88 | C15.+ 24.77,25.91 | v24.77,26.35 24.77,25.91 | 24.77,25.91 v24.77,25.4
  Route15 1.016: v36.51,25.88 24.77,25.88 | 24.77,25.88 v24.77,26.35 | 24.77,25.88 v24.77,25.4
DC_IN
  Top 1.27: J1.1 12.61,35.56 FB1.1
DC_IN_FLT
  Top 0.406: 14.29,29.84 14.92,29.85 U2.2 U2.1
  Top 0.61: 14.29,29.84 C10.+
  Top 1.27: FB1.2 12.38,29.98 C10.+
GND  (via drill 0.3, 0.61)
  Top 0.61: C9.2 v47.78,16.03 | R1.1 v47.78,17.62 | C8.2 v48.42,11.27 | v48.42,11.27 | C7.2 v35.4,11.27 | C4.2 v36.04,15.88 | C5.2 v37.78,23.5 | C6.2 v39.37,23.5 | C12.2 v44.45,23.5 | C11.2 v46.04,23.5
  Top 0.813: FLT1.6 arc90 44.13,11.13 v44.13,11.91 | FLT1.1 arc-90 39.69,11.58 v39.69,11.91
  other vias: 40.96,20.95 41.91,20.95 42.86,20.95 42.86,20 42.86,19.05 41.91,19.05 40.96,20 40.96,19.05 41.91,14.29 41.27,13.49 40.48,12.7 42.55,13.49 43.34,12.7 43.02,11.75 40.8,11.75 41.91,11.75 36.67,18.89 37.78,18.89 31.11,21.59 32.38,21.59 34.92,21.59 36.2,21.59 37.47,21.59 46.35,21.59 47.62,21.59 48.9,21.59 49.53,22.54 50.8,22.86 52.07,22.86 53.34,22.86 49.21,18.73 49.53,17.46 50.8,17.14 52.07,17.14 53.34,17.14 54.61,17.14 55.88,17.46 54.61,22.86 55.88,22.54 56.83,21.59 58.1,21.59 56.83,18.41 58.1,18.41 59.37,18.41 51.75,1.27 49.85,1.27 47.94,1.27 46.04,1.27 44.13,1.27 42.23,1.27 40.32,1.27 38.42,1.27 36.51,1.27 34.61,1.27 32.7,1.27 30.8,1.27 28.89,1.27 26.99,1.27 25.08,1.27 23.18,1.27 21.27,1.27 19.37,1.27 17.46,1.27 15.56,1.27 13.65,1.27 11.75,1.27 62.23,38.73 60.33,38.73 58.42,38.73 56.52,38.73 54.61,38.73 52.7,38.73 50.8,38.73 48.9,38.73 46.99,38.73 45.09,38.73 33.66,38.73 43.18,38.73 41.27,38.73 39.37,38.73 37.47,38.73 35.56,38.73 38.73,14.92 38.1,14.29 37.47,13.65 36.83,13.02 36.51,9.84 37.15,8.89 38.1,7.94 39.05,6.99 40.01,6.35 41.27,6.35 42.55,6.35 43.81,6.35 45.09,6.99 45.72,8.26 46.67,9.21 45.4,14.61 46.35,13.97 46.99,13.02 33.66,21.59 59.37,21.59 62.87,21.59 64.14,21.59 65.41,21.59 66.36,21.59 67.31,21.59 68.26,21.59 69.22,21.59 67.31,11.75 68.26,11.75 66.36,11.75 65.41,11.75 65.09,15.88 66.04,15.88 66.04,16.83 70.17,13.97 70.17,14.92 69.53,15.88 69.53,16.83 53.66,1.27 55.56,1.27 57.47,1.27 59.37,1.27 61.28,1.27 63.18,1.27 65.09,1.27 66.99,1.27 68.58,1.27 41.91,20 63.82,37.15 63.82,35.24 63.82,33.34 63.82,31.43 64.14,25.08 66.36,25.08 68.9,25.08 71.44,25.08 68.58,3.17 68.58,5.08 68.58,6.99 68.58,9.53 69.85,10.79 71.12,12.06 72.39,13.34 73.66,14.61 11.75,3.17 11.75,5.08 11.75,6.99 11.75,8.89 10.48,10.48 9.21,11.75 7.94,13.02 6.35,14.61 31.75,38.73 29.84,38.73 26.35,38.73 28.26,38.73 26.35,36.51 26.35,34.29 26.35,32.07 26.35,29.84 26.35,22.54 20.32,22.54 18.41,22.54 16.51,22.54 14.61,22.54 12.7,22.54 10.79,22.54 8.89,22.54 6.99,22.54 26.99,24.13 26.99,27.62 70.17,21.59 72.39,21.59 73.34,21.59 73.34,22.86 62.87,18.73 66.04,18.41 69.53,18.73 69.53,17.78 64.45,14.92 64.45,13.65 64.45,12.38 70.8,18.73 72.07,18.73 73.34,18.73 6.67,18.73 7.94,18.73 9.21,18.73 10.48,18.73 11.75,18.73 13.02,18.73 14.29,18.73 15.56,18.73 16.83,18.73 18.41,18.73 19.37,17.78 19.37,16.83 18.73,15.88 18.1,14.92 17.78,13.97 17.78,12.7 18.41,11.75 19.68,11.43 20.8,11.43 21.91,11.43 23.02,11.75 23.81,12.7 23.97,13.97 23.81,15.08 22.86,16.03 22.23,16.83 22.38,18.26 23.65,18.73 27.15,18.73 22.23,22.54 24.13,22.54 30.48,18.73 31.75,18.73 33.34,18.73 46.35,18.73 47.94,18.73 73.98,24.77 63.82,29.21 63.82,27.3
  pour Bottom: 0.32,39.69 79.69,39.69 79.69,0.32 0.32,0.32
  pour Top: 0,40.01 80.01,40.01 80.01,0 0,0
  pour Route2: 0,40.01 80.01,40.01 80.01,0 0,0
  pour Route15: 0,40.01 80.01,40.01 80.01,0 0,0
N$1
  Top 0.305: U1.19 41.26,23.51 40.96,23.81 L2.2
N$2
  Top 0.64: ANT.C C2.1
N$3
  Top 0.406: U2.4 15.9,28.23
  Top 0.61: 15.9,28.23 15.91,28.23 C13.1
N$4
  Top 0.61: L1.2 36.35,17.46 C3.1
N$5
  Top 0.203: 39.21,18.6 U1.5
  Top 0.61: C4.1 C3.2 38.89,17.78 39.21,18.1 39.21,18.6
N$6
  Top 0.203: U1.11 44.61,18.6
  Top 0.406: R1.2 C9.1
  Top 0.61: R1.2 44.93,17.62 44.61,17.94 44.61,18.6
N$7
  Top 0.64: C1.1 X1.SIG
N$8
  Top 1.016: RX_OUT_UFL.SIG C17.2
N$9
  Top 0.254: D2.2 64.77,20
  Top 0.64: FLT2.5 64.77,20 67.44,20 C17.1 67.47,20 C18.1
N$10
  Top 0.305: U1.17 42.56,23.51 42.86,23.81 L3.2
N$11  (via drill 0.3)
  Top 0.61: L4.2 71.28,22.38 v71.44,22.54 v72.07,23.18
  Route15 0.61: v71.44,22.54 v72.07,23.18 72.71,23.81 72.71,29.53 71.75,30.48
  Route15 1.27: 71.75,30.48 J2.1
N$12
  Top 0.406: U2.3 14.91,29.2 14.29,28.57
  Top 0.61: 14.29,28.57 13.65,27.94 13.15,27.94 C14.+ 12.51,25.37 FB2.1
RF_UPLINK
  Top 0.254: C2.2 20.8,20 C1.2
  Top 0.305: 38.42,20 U1.3 | D1.2 25.4,20
  Top 0.61: 37.78,20 38.42,20
  Top 0.64: 35.4,20 37.78,20 | 35.4,20 L1.1 | 35.4,20 25.4,20 C2.2
RF_UPLINK_IS_IN
  Top 0.203: 45.25,12.68 C8.1
  Top 0.305: 42.56,16.52 U1.9
  Top 0.61: 42.56,16.05 42.56,16.52
  Top 1.016: FLT1.5 43.81,9.21 arc135 45.25,12.68 43.16,14.61 arc-45 42.56,16.05
RF_UPLINK_IS_OUT
  Top 0.203: C7.1 38.57,12.68
  Top 0.305: 41.26,16.52 U1.7
  Top 0.61: 41.26,16.05 41.26,16.52
  Top 0.813: 40.01,9.21 FLT1.2
  Top 1.016: 41.26,16.05 arc-45 40.66,14.61 38.57,12.68 arc135 40.01,9.21
RF_UPLINK_LNA_OUT
  Top 0.305: U1.13 45.4,20
  Top 0.61: 45.4,20 46.04,20
  Top 0.64: 46.04,20 FLT2.2
RF_UPLINK_OUT
  Top 0.61: 70.48,20 71.28,20 L4.1
  Top 0.64: BTS.C 70.48,20 C18.2

### Text on the board
tNames: + | + | osmo-BTS-LNA | v1 | CC-BY-SA
bNames: CC-BY-SA | v1 | osmo-BTS-LNA | (c) sysmocom GmbH + Munaut.S